# EAGLE schematic RX-FM-Radio-Circuit-Mirrored (EAGLE 7.2.0)
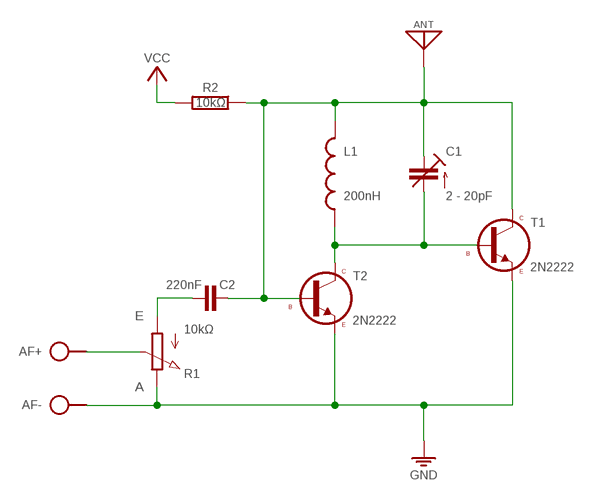
[diagram p0: schematic, sheet 1]

## Parts
AF  SPAD+-+-  [SPAD+-]
ANT  ANT  [SPAD]
BAT  VCC_GNDL  [SPAD-+]
C1  2 - 20pF  C-TR-PH201272222-808-2PIN  [TRIM-2222-808]
C2  220nF  C-H050-020X044  [C050-020X044]
L1  200nH  L04/7-V  [L-04/7-V]
R1  10kΩ  POT-3P  [CONN-3P]
R2  10kΩ  R-H0204/10  [0204/10]
T1  2N2222  [TO92-EBC]
T2  2N2222  [TO92-EBC]

## Nets
GND: AF.1 BAT.1 R1.3(E) T1.E T2.E
N$1: C1.2(A) L1.2 T1.B T2.C
N$3: C2.2 R1.1(A)
N$4: ANT.1 C1.1(E) C2.1 L1.1 R2.1 T1.C T2.B
N$6: AF.2 R1.2(S)
VCC: BAT.2 R2.2

## Library data of the parts
AF = pad:SPAD+-
ANT = pad:ANT
BAT = pad:VCC_GND
C1 = cap-trim:C-TR-PH20127
C2 = c:C-H
L1 = l:L: Potentiometers Beckman, Copal, Piher, Spectrol, Schukat Created by librarian@cadsoft.de
R1 = r:POT
R2 = r:R-H
T1 T2 = t:2N2222